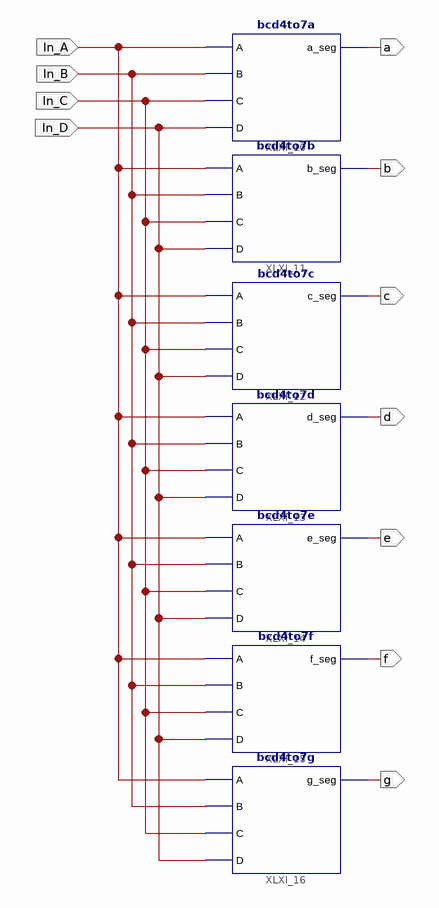
[diagram p0: schematic sheet 1]
// Xilinx ISE schematic bcd.sch (spartan6) as structural Verilog: 7 symbols, 11 ports
module bcd (
  input  In_A,
  input  In_B,
  input  In_C,
  input  In_D,
  output g,
  output f,
  output e,
  output d,
  output c,
  output b,
  output a
);

  bcd4to7a XLXI_10 (.A(In_A), .B(In_B), .C(In_C), .D(In_D), .a_seg(a));
  bcd4to7b XLXI_11 (.A(In_A), .B(In_B), .C(In_C), .D(In_D), .b_seg(b));
  bcd4to7c XLXI_12 (.A(In_A), .B(In_B), .C(In_C), .D(In_D), .c_seg(c));
  bcd4to7d XLXI_13 (.A(In_A), .B(In_B), .C(In_C), .D(In_D), .d_seg(d));
  bcd4to7e XLXI_14 (.A(In_A), .B(In_B), .C(In_C), .D(In_D), .e_seg(e));
  bcd4to7f XLXI_15 (.A(In_A), .B(In_B), .C(In_C), .D(In_D), .f_seg(f));
  bcd4to7g XLXI_16 (.A(In_A), .B(In_B), .C(In_C), .D(In_D), .g_seg(g));
endmodule
